# EAGLE design diyAutoSteer (EAGLE 9.5.1)
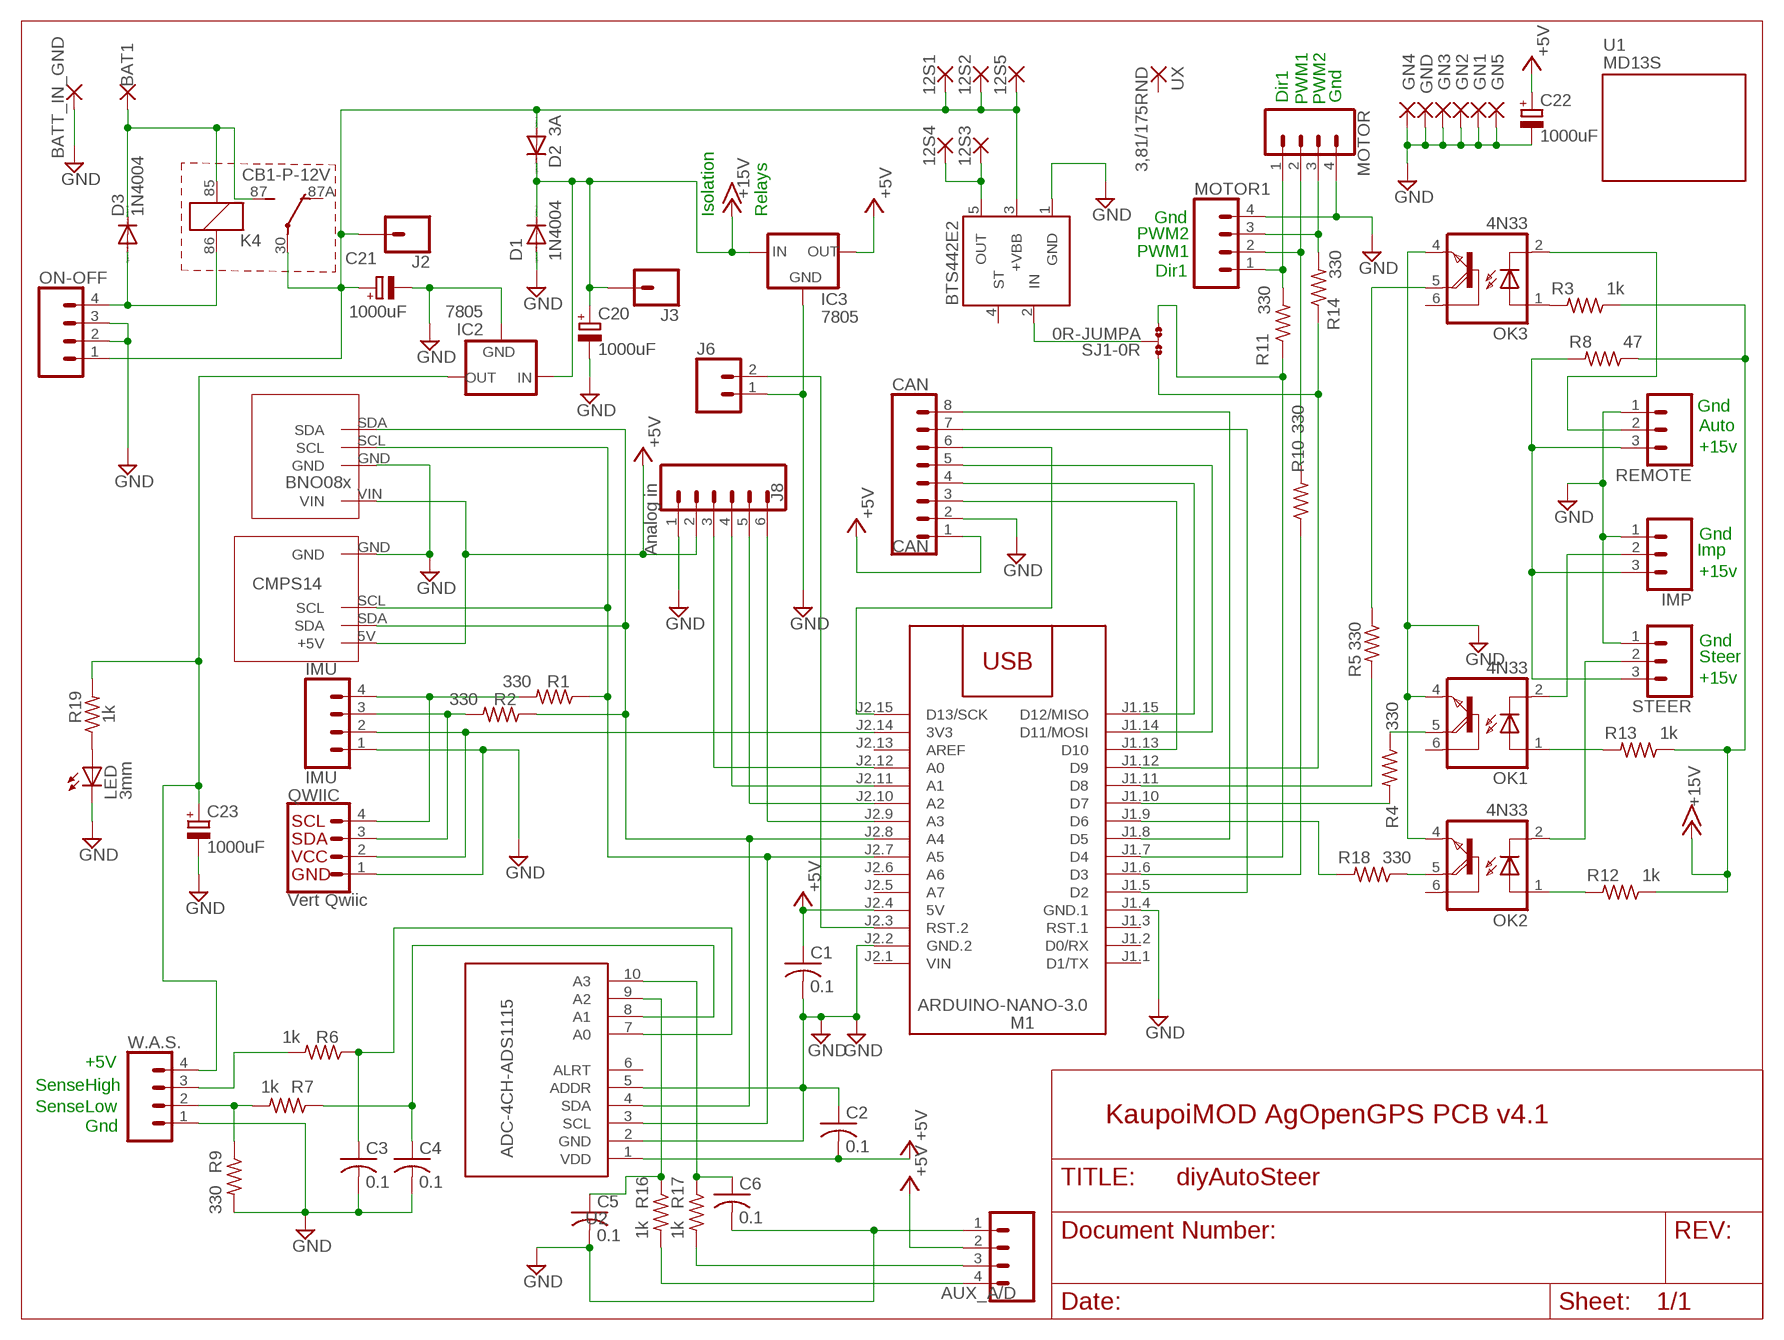
[diagram p0: schematic, sheet 1]

## Parts
12S1  3,81/1,65  [3,81/1,65]
12S2  3,81/1,65  [3,81/1,65]
12S3  3,81/1,65  [3,81/1,65]
12S4  3,81/1,65  [3,81/1,65]
12S5  3,81/1,65  [3,81/1,65]
AUX_A/D  CONN_04LONGPADS  [1X04_LONGPADS]
BAT1  3,81/1,65  [3,81/1,65]
BATT_IN_GND  3,81/1,65  [3,81/1,65]
C1  0.1  C-US025-025X050  [C025-025X050]
C2  0.1  C-US025-025X050  [C025-025X050]
C3  0.1  C-US025-025X050  [C025-025X050]
C4  0.1  C-US025-025X050  [C025-025X050]
C5  0.1  C-US025-025X050  [C025-025X050]
C6  0.1  C-US025-025X050  [C025-025X050]
C20  1000uF  CPOL-EUE5-13  [E5-13]
C21  1000uF  CPOL-EUE5-13  [E5-13]
C22  1000uF  CPOL-EUE5-13  [E5-13]
C23  1000uF  CPOL-EUE5-13  [E5-13]
CAN  CAN  CONN_08NO_SILK_FEMALE_PTH  [1X08_NO_SILK]
D1  1N4004  [DO41-10]
D2  3A  DIODE-DO27-15  [DO27-15]
D3  1N4004  [DO41-10]
GN1  3,81/1,65  [3,81/1,65]
GN2  3,81/1,65  [3,81/1,65]
GN3  3,81/1,65  [3,81/1,65]
GN4  3,81/1,65  [3,81/1,65]
GN5  3,81/1,65  [3,81/1,65]
GND  3,81/1,65  [3,81/1,65]
IC2  7805  78XXS  [78XXS]
IC3  7805  78XXS  [78XXS]
IMP  CONN_03LONGPADS  [1X03_LONGPADS]
IMU  IMU  CONN_04LONGPADS  [1X04_LONGPADS]
J2  CONN_01  [1X01]
J3  CONN_01  [1X01]
J6  CONN_02PTH3  [1X02_LONGPADS]
J8  Analog in  CONN_06NO_SILK_NO_POP  [1X06_NO_SILK]
K4  CB1-P-12V  [CB1]
LED  3mm  LED3MM  [LED3MM]
M1  ARDUINO-NANO-3.0  [ARDUINO-NANO-3.0]
MOTOR  CONN_04LONGPADS  [1X04_LONGPADS]
MOTOR1  CONN_04LONGPADS  [1X04_LONGPADS]
OK1  4N33  [DIL06]
OK2  4N33  [DIL06]
OK3  4N33  [DIL06]
ON-OFF  CONN_04LONGPADS  [1X04_LONGPADS]
QWIIC  Vert Qwiic  QWIIC_CONNECTOR  [JST04_1MM_VERT]
R1  330  R-US_0309/12  [0309/12]
R2  330  R-US_0309/12  [0309/12]
R3  1k  R-US_0309/12  [0309/12]
R4  330  R-US_0309/12  [0309/12]
R5  330  R-US_0309/12  [0309/12]
R6  1k  R-US_0309/12  [0309/12]
R7  1k  R-US_0309/12  [0309/12]
R8  47  R-US_0309/12  [0309/12]
R9  330  R-US_0309/12  [0309/12]
R10  330  R-US_0309/12  [0309/12]
R11  330  R-US_0309/12  [0309/12]
R12  1k  R-US_0309/12  [0309/12]
R13  1k  R-US_0309/12  [0309/12]
R14  330  R-US_0309/12  [0309/12]
R16  1k  R-US_0309/12  [0309/12]
R17  1k  R-US_0309/12  [0309/12]
R18  330  R-US_0309/12  [0309/12]
R19  1k  R-US_0309/12  [0309/12]
REMOTE  CONN_03LONGPADS  [1X03_LONGPADS]
SJ1  0R-JUMPA  [A0R-JMP]
STEER  CONN_03LONGPADS  [1X03_LONGPADS]
U1  MD13S  [MD13S]
U2  ADC-4CH-ADS1115  [ADC-4CH-ADS1115]
U3  BTS442E2  [TO220-5]
U4  CMPS14  [CMPS14]
U5  BNO085  [BNO085]
UX  3,81/175RND  [3,81/1,75RND]
W.A.S.  CONN_04LONGPADS  [1X04_LONGPADS]

## Nets
+5V: AUX_A/D.2 C1.1 C2.2 C22.+ CAN.1 IC3.OUT J8.2 M1.J2.4(5V) U2.1(VDD) U4.5V(+5V) U5.VIN
+15V: C20.+ D1.C D2.C IC2.IN IC3.IN J3.1 R3.1 R8.1 R12.1 R13.1
BATT: BAT1.P$1(P) D3.C K4.85 K4.87(2:S)
DIR: MOTOR1.1 MOTOR.1 R11.2
GND: AUX_A/D.1 BATT_IN_GND.P$1(P) C1.2 C2.1 C3.2 C4.2 C5.2 C6.2 C20.- C21.- C22.- C23.- CAN.2 D1.A GN1.P$1(P) GN2.P$1(P) GN3.P$1(P) GN4.P$1(P) GN5.P$1(P) GND.P$1(P) IC2.GND IC3.GND IMP.1 IMU.1 J6.1 J8.1 LED.K(C) M1.J1.4(GND.1) M1.J2.2(GND.2) MOTOR1.4 MOTOR.4 OK1.4(E) OK2.4(E) OK3.4(E) ON-OFF.2 ON-OFF.3 QWIIC.1 R9.2 REMOTE.1 STEER.1 U2.2(GND) U2.5(ADDR) U3.1(GND) U4.GND U5.GND W.A.S..1
N$1: IMU.2 M1.J2.14(3V3) QWIIC.2
N$2: R7.2 R9.1 W.A.S..2
N$3: IMP.3 R8.2 REMOTE.3 STEER.3
N$4: M1.J1.6(D3) R10.1
N$5: M1.J1.7(D4) R11.1 SJ1.3
N$6: CAN.7 M1.J1.5(D2)
N$7: J6.2 M1.J2.3(RST.2)
N$8: R6.2 W.A.S..3
N$9: CAN.8 M1.J1.8(D5)
N$10: J8.4 M1.J2.11(A1)
N$11: M1.J1.12(D9) R14.1 SJ1.1
N$12: IMU.3 QWIIC.3 R2.2
N$13: IMU.4 QWIIC.4 R1.2
N$14: J8.5 M1.J2.10(A2)
N$15: J8.6 M1.J2.9(A3)
N$16: LED.A R19.1
N$17: CAN.6 M1.J2.15(D13/SCK)
N$18: AUX_A/D.3 R17.2
N$19: OK1.5(COL) R4.1
N$20: C3.1 R6.1 U2.7(A0)
N$21: CAN.5 M1.J1.14(D11/MOSI)
N$22: OK2.2(C) STEER.2
N$23: M1.J1.11(D8) R5.2
N$24: D3.A K4.86 ON-OFF.4
N$25: OK2.1(A) R12.2
N$26: OK3.1(A) R3.2
N$27: M1.J1.10(D7) R4.2
N$28: OK3.2(C) REMOTE.2
N$29: IMP.2 OK1.2(C)
N$30: J8.3 M1.J2.12(A0)
N$31: M1.J1.9(D6) R18.2
N$32: OK1.1(A) R13.2
N$33: CAN.4 M1.J1.15(D12/MISO)
N$34: OK3.5(COL) R5.1
N$35: C6.1 R17.1 U2.10(A3)
N$36: C5.1 R16.1 U2.9(A2)
N$37: CAN.3 M1.J1.13(D10)
N$38: M1.J2.7(A5) R1.1 U2.3(SCL) U4.SCL U5.SCL
N$39: OK2.5(COL) R18.1
N$40: 12S3.P$1(P) 12S4.P$1(P) U3.5(OUT)
N$41: SJ1.2 U3.2(IN)
N$44: C4.1 R7.1 U2.8(A1)
N$47: AUX_A/D.4 R16.2
PWM1: MOTOR1.2 MOTOR.2 R10.2
PWM2: MOTOR1.3 MOTOR.3 R14.2
SDA: M1.J2.8(A4) R2.1 U2.4(SDA) U4.SDA U5.SDA
SW_RAW: 12S1.P$1(P) 12S2.P$1(P) 12S5.P$1(P) C21.+ D2.A J2.1 K4.30(2:P) ON-OFF.1 U3.3(+VBB)
V+WAS: C23.+ IC2.OUT R19.2 W.A.S..4
Unconnected: K4.87A(2:O) M1.J1.1(D1/TX) M1.J1.2(D0/RX) M1.J1.3(RST.1) M1.J2.5(A7) M1.J2.6(A6) M1.J2.13(AREF) OK1.6(B) OK2.6(B) OK3.6(B) U2.6(ALRT) U3.4(ST) UX.P$1(P)

## Notes on the sheet
- Dir1 | PWM1 | PWM2 | Gnd
- Gnd
- Isolation | Relays
- PWM2
- PWM1
- Dir1
- Gnd
- Auto
- +15v
- Gnd
- Imp
- +15v
- Gnd
- Steer
- +15v
- +5V
- Sense | High
- Sense | Low
- KaupoiMOD AgOpenGPS PCB v4.1
- Gnd

## Power pins joined to a net without a drawn wire
VIN: M1.J2.1(VIN)

## Library data of the parts
12S1-12S5 BAT1 BATT_IN_GND GN1-GN5 GND = wirepad:3,81/1,65: 3,81/1,65
AUX_A/D IMU MOTOR MOTOR1 ON-OFF W.A.S. = SparkFun-Connectors:CONN_04: Multi connection point. Often used as Generic Header-pin footprint for 0.1 inch spaced/style header connections On any of the 0.1 inch spaced packages, you can populate with these: Break Away Headers - Straight <https://www.sparkfun.com/products/116> (PRT-00116) Break Away Male Headers - Right Angle <https://www.sparkfun.com/products/553> (PRT-00553) Female Headers <https://www.sparkfun.com/products/115> (PRT-00115) Break Away Headers - Machine Pin <https://www.sparkfun.com/products/117> (PRT-00117) Break Away Female Headers - Swiss Machine Pin <https://www.sparkfun.com/products/743> (PRT-00743) For SCREWTERMINALS and SPRING TERMINALS visit here: Screw Terimnals on SparkFun.com <https://www.sparkfun.com/search/results?term=Screw+Terminals> (5mm/3.5mm/2.54mm spacing) This device is also useful as a general connection point to wire up your design to another part of your project. Our various solder wires solder well into these plated through hole pads. Hook-Up Wire - Assortment (Stranded, 22 AWG) <https://www.sparkfun.com/products/11375> (PRT-11375) Hook-Up Wire - Assortment (Solid Core, 22 AWG) <https://www.sparkfun.com/products/11367> (PRT-11367) View the entire wire category on our website here <https://www.sparkfun.com/categories/141> Special notes: Molex polarized connector foot print use with SKU : PRT-08231 with associated crimp pins and housings. 1MM SMD Version SKU: PRT-10208; PROD_ID: CONN-09696
C1-C6 = rcl:C-US: CAPACITOR, American symbol
C20 = rcl:CPOL-EU: POLARIZED CAPACITOR, European symbol; SPICEPREFIX: C
C21-C23 = rcl:CPOL-EU: POLARIZED CAPACITOR, European symbol
CAN = SparkFun-Connectors:CONN_08: Multi connection point. Often used as Generic Header-pin footprint for 0.1 inch spaced/style header connections On any of the 0.1 inch spaced packages, you can populate with these: Break Away Headers - Straight <https://www.sparkfun.com/products/116> (PRT-00116) Break Away Male Headers - Right Angle <https://www.sparkfun.com/products/553> (PRT-00553) Female Headers <https://www.sparkfun.com/products/115> (PRT-00115) Break Away Headers - Machine Pin <https://www.sparkfun.com/products/117> (PRT-00117) Break Away Female Headers - Swiss Machine Pin <https://www.sparkfun.com/products/743> (PRT-00743) Arduino Stackable Header - 8 Pin <https://www.sparkfun.com/products/9279> (PRT-09279) For SCREWTERMINALS and SPRING TERMINALS visit here: Screw Terimnals on SparkFun.com <https://www.sparkfun.com/search/results?term=Screw+Terminals> (5mm/3.5mm/2.54mm spacing) This device is also useful as a general connection point to wire up your design to another part of your project. Our various solder wires solder well into these plated through hole pads. Hook-Up Wire - Assortment (Stranded, 22 AWG) <https://www.sparkfun.com/products/11375> (PRT-11375) Hook-Up Wire - Assortment (Solid Core, 22 AWG) <https://www.sparkfun.com/products/11367> (PRT-11367) View the entire wire category on our website here <https://www.sparkfun.com/categories/141> Special notes: Molex polarized connector foot print use with SKU : PRT-08231 with associated crimp pins and housings. 1MM SMD Version SKU: PRT-10208 NOTES ON THE VARIANTS LOCK and LOCK_LONGPADS... This footprint was designed to help hold the alignment of a through-hole component (i.e. 6-pin header) while soldering it into place. You may notice that each hole has been shifted either up or down by 0.005 of an inch from it's more standard position (which is a perfectly straight line). This slight alteration caused the pins (the squares in the middle) to touch the edges of the holes. Because they are alternating, it causes a "brace" to hold the component in place. 0.005 has proven to be the perfect amount of "off-center" position when using our standard breakaway headers. Although looks a little odd when you look at the bare footprint, once you have a header in there, the alteration is very hard to notice. Also,if you push a header all the way into place, it is covered up entirely on the bottom side.; PROD_ID: CONN-08438
D1 D3 = diode:1N4004: DIODE general purpose rectifier, 1 A
D2 = diode:DIODE-: DIODE
IC2 IC3 = v-reg:78XXS: VOLTAGE REGULATOR
IMP REMOTE STEER = SparkFun-Connectors:CONN_03: Multi connection point. Often used as Generic Header-pin footprint for 0.1 inch spaced/style header connections On any of the 0.1 inch spaced packages, you can populate with these: Break Away Headers - Straight <https://www.sparkfun.com/products/116> (PRT-00116) Break Away Male Headers - Right Angle <https://www.sparkfun.com/products/553> (PRT-00553) Female Headers <https://www.sparkfun.com/products/115> (PRT-00115) Break Away Headers - Machine Pin <https://www.sparkfun.com/products/117> (PRT-00117) Break Away Female Headers - Swiss Machine Pin <https://www.sparkfun.com/products/743> (PRT-00743) Stackable Header - 3 Pin (Female, 0.1") <https://www.sparkfun.com/products/13875> (PRT-13875) For SCREWTERMINALS and SPRING TERMINALS visit here: Screw Terimnals on SparkFun.com <https://www.sparkfun.com/search/results?term=Screw+Terminals> (5mm/3.5mm/2.54mm spacing) This device is also useful as a general connection point to wire up your design to another part of your project. Our various solder wires solder well into these plated through hole pads. Hook-Up Wire - Assortment (Stranded, 22 AWG) <https://www.sparkfun.com/products/11375> (PRT-11375) Hook-Up Wire - Assortment (Solid Core, 22 AWG) <https://www.sparkfun.com/products/11367> (PRT-11367) View the entire wire category on our website here <https://www.sparkfun.com/categories/141> Special notes: Molex polarized connector foot print use with SKU : PRT-08232 with associated crimp pins and housings.
J2 J3 = SparkFun-Connectors:CONN_01: Single connection point. Often used as Generic Header-pin footprint for 0.1 inch spaced/style header connections On any of the 0.1 inch spaced packages, you can populate with these: Break Away Headers - Straight <https://www.sparkfun.com/products/116> (PRT-00116) Break Away Male Headers - Right Angle <https://www.sparkfun.com/products/553> (PRT-00553) Female Headers <https://www.sparkfun.com/products/115> (PRT-00115) Break Away Headers - Machine Pin <https://www.sparkfun.com/products/117> (PRT-00117) Break Away Female Headers - Swiss Machine Pin <https://www.sparkfun.com/products/743> (PRT-00743) This device is also useful as a general connection point to wire up your design to another part of your project. Our various solder wires solder well into these plated through hole pads. Hook-Up Wire - Assortment (Stranded, 22 AWG) <https://www.sparkfun.com/products/11375> (PRT-11375) Hook-Up Wire - Assortment (Solid Core, 22 AWG) <https://www.sparkfun.com/products/11367> (PRT-11367) View the entire wire category on our website here <https://www.sparkfun.com/categories/141> Special notes: SMTSO-256-ET is a "flush mount" nut for a 4-40 screw. We mostly use this on specialty testbeds; it is a nice way to connect hardware to your PCB at an adjustable hieght. Also note, the SNAP packages are for using a snappable style connector. We sell a baggie of snaps and they are also used on two LilyPad designs: Snap Assortment - 30 pack (male and female) <https://www.sparkfun.com/products/11347> (DEV-11347) LilyPad Arduino SimpleSnap <https://www.sparkfun.com/products/10941> (DEV-10941) LilyPad SimpleSnap Protoboard <https://www.sparkfun.com/products/10940> (DEV-10940)
J6 = SparkFun-Connectors:CONN_02: Multi connection point. Often used as Generic Header-pin footprint for 0.1 inch spaced/style header connections On any of the 0.1 inch spaced packages, you can populate with these: Break Away Headers - Straight <https://www.sparkfun.com/products/116> (PRT-00116) Break Away Male Headers - Right Angle <https://www.sparkfun.com/products/553> (PRT-00553) Female Headers <https://www.sparkfun.com/products/115> (PRT-00115) Break Away Headers - Machine Pin <https://www.sparkfun.com/products/117> (PRT-00117) Break Away Female Headers - Swiss Machine Pin <https://www.sparkfun.com/products/743> (PRT-00743) For SCREWTERMINALS and SPRING TERMINALS visit here: Screw Terimnals on SparkFun.com <https://www.sparkfun.com/search/results?term=Screw+Terminals> (5mm/3.5mm/2.54mm spacing) This device is also useful as a general connection point to wire up your design to another part of your project. Our various solder wires solder well into these plated through hole pads. Hook-Up Wire - Assortment (Stranded, 22 AWG) <https://www.sparkfun.com/products/11375> (PRT-11375) Hook-Up Wire - Assortment (Solid Core, 22 AWG) <https://www.sparkfun.com/products/11367> (PRT-11367) View the entire wire category on our website here <https://www.sparkfun.com/categories/141> Special notes: Molex polarized connector foot print use with: PRT-08233 with associated crimp pins and housings. 2.54_SCREWTERM for use with PRT-10571. 3.5mm Screw Terminal footprints for PRT-08084 5mm Screw Terminal footprints for use with PRT-08432
J8 = SparkFun-Connectors:CONN_06: Multi connection point. Often used as Generic Header-pin footprint for 0.1 inch spaced/style header connections On any of the 0.1 inch spaced packages, you can populate with these: Break Away Headers - Straight <https://www.sparkfun.com/products/116> (PRT-00116) Break Away Male Headers - Right Angle <https://www.sparkfun.com/products/553> (PRT-00553) Female Headers <https://www.sparkfun.com/products/115> (PRT-00115) Break Away Headers - Machine Pin <https://www.sparkfun.com/products/117> (PRT-00117) Break Away Female Headers - Swiss Machine Pin <https://www.sparkfun.com/products/743> (PRT-00743) Arduino Stackable Header - 6 Pin <https://www.sparkfun.com/products/9280> (PRT-09280) For SCREWTERMINALS and SPRING TERMINALS visit here: Screw Terimnals on SparkFun.com <https://www.sparkfun.com/search/results?term=Screw+Terminals> (5mm/3.5mm/2.54mm spacing) This device is also useful as a general connection point to wire up your design to another part of your project. Our various solder wires solder well into these plated through hole pads. Hook-Up Wire - Assortment (Stranded, 22 AWG) <https://www.sparkfun.com/products/11375> (PRT-11375) Hook-Up Wire - Assortment (Solid Core, 22 AWG) <https://www.sparkfun.com/products/11367> (PRT-11367) View the entire wire category on our website here <https://www.sparkfun.com/categories/141>
K4 = relay:CB1*: HIGH POWER AUTOMOTIVE RELAY Form C NAiS Source: http://www.mew-europe.com/.. en_ds_61202_0000.pdf; MF: AROMAT/ MATSUSHITA; MPN: CB1-P-12V; OC_FARNELL: unknown; OC_NEWARK: 52F9201
LED = led:LED: LED OSRAM: - CHIPLED LG R971, LG N971, LY N971, LG Q971, LY Q971, LO R971, LY R971 LH N974, LH R974 LS Q976, LO Q976, LY Q976 LO Q996 - Hyper CHIPLED LW Q18S LB Q993, LB Q99A, LB R99A - SideLED LS A670, LO A670, LY A670, LG A670, LP A670 LB A673, LV A673, LT A673, LW A673 LH A674 LY A675 LS A676, LA A676, LO A676, LY A676, LW A676 LS A679, LY A679, LG A679 - Hyper Micro SIDELED® LS Y876, LA Y876, LO Y876, LY Y876 LT Y87S - SmartLED LW L88C, LW L88S LB L89C, LB L89S, LG L890 LS L89K, LO L89K, LY L89K LS L896, LA L896, LO L896, LY L896 - TOPLED LS T670, LO T670, LY T670, LG T670, LP T670 LSG T670, LSP T670, LSY T670, LOP T670, LYG T670 LG T671, LOG T671, LSG T671 LB T673, LV T673, LT T673, LW T673 LH T674 LS T676, LA T676, LO T676, LY T676, LB T676, LH T676, LSB T676, LW T676 LB T67C, LV T67C, LT T67C, LS T67K, LO T67K, LY T67K, LW E67C LS E67B, LA E67B, LO E67B, LY E67B, LB E67C, LV E67C, LT E67C LW T67C LS T679, LY T679, LG T679 LS T770, LO T770, LY T770, LG T770, LP T770 LB T773, LV T773, LT T773, LW T773 LH T774 LS E675, LA E675, LY E675, LS T675 LS T776, LA T776, LO T776, LY T776, LB T776 LHGB T686 LT T68C, LB T68C - Hyper Mini TOPLED® LB M676 - Mini TOPLED Santana® LG M470 LS M47K, LO M47K, LY M47K Source: http://www.osram.convergy.de LUXEON: - LUMILED® LXK2-PW12-R00, LXK2-PW12-S00, LXK2-PW14-U00, LXK2-PW14-V00 LXK2-PM12-R00, LXK2-PM12-S00, LXK2-PM14-U00 LXK2-PE12-Q00, LXK2-PE12-R00, LXK2-PE12-S00, LXK2-PE14-T00, LXK2-PE14-U00 LXK2-PB12-K00, LXK2-PB12-L00, LXK2-PB12-M00, LXK2-PB14-N00, LXK2-PB14-P00, LXK2-PB14-Q00 LXK2-PR12-L00, LXK2-PR12-M00, LXK2-PR14-Q00, LXK2-PR14-R00 LXK2-PD12-Q00, LXK2-PD12-R00, LXK2-PD12-S00 LXK2-PH12-R00, LXK2-PH12-S00 LXK2-PL12-P00, LXK2-PL12-Q00, LXK2-PL12-R00 Source: www.luxeon.com KINGBRIGHT: KA-3528ASYC Source: www.kingbright.com
M1 = diy-modules:ARDUINO-NANO-3.0: Arduino Nano 3.0 and compatible devices More details available here: https://www.arduino.cc/en/Main/ArduinoBoardNano Click here to find device on ebay.com <http://www.ebay.com/sch/arduino+nano>
OK1-OK3 = optocoupler:4N33: MOTOROLA OPTO COUPLER; MF: VISHAY/TELEFUNKEN; MPN: 4N33; OC_FARNELL: 1469601; OC_NEWARK: 88K1390
QWIIC = SparkFun-Connectors:QWIIC_CONNECTOR: SparkFun I2C Standard Qwiic Connector An SMD 1mm pitch JST connector makes it easy and quick (get it? Qwiic?) to connect I2C devices to each other. The Qwiic system <http://www.sparkfun.com/qwiic> enables fast and solderless connection between popular platforms and various sensors and actuators. We carry 200mm <https://www.sparkfun.com/products/14204>, 100mm <https://www.sparkfun.com/products/14205>, 50mm <https://www.sparkfun.com/products/14206>, and breadboard friendly <https://www.sparkfun.com/products/14207> Qwiic cables. We also offer 10 pcs strips <https://www.sparkfun.com/products/14323> the SMD connectors.; PROD_ID: CONN-14483; VALUE: Vertical Qwiic Connector
R1-R14 R16-R19 = rcl:R-US_: RESISTOR, American symbol
SJ1 = jump-0r-smd:0R-JUMP: SMD 0R 0805 Jumper
U1 = cytronMD13Sholes:MD13S: 13Amp DC Motor Driver (MD13S) Created by: Wai Weng; CYTRON-PC: MD13S; DESC: 13Amp DC Motor Driver - GROVE Compatible; MF: Cytron; MPN: MD13S
U2 = diy-modules:ADC-4CH-ADS1115: 4 Channel 16-Bit Analog-to-Digital Converter based on ADS1115 chip Arduino ADS1115 Getting Started Tutorial is available here: http://henrysbench.capnfatz.com/henrys-bench/arduino-voltage-measurements/arduino-ads1115-module-getting-started-tutorial/ ADS1115 datasheet is available here: http://www.ti.com/lit/ds/symlink/ads1115.pdf Click here to find device on ebay.com <http://www.ebay.com/sch/ads1115+module>
U3 = v-reg-3:BTS442E2
U4 = IMU:CMPS14: CMPS14
U5 = IMU:BNO085
UX = wirepad:3,81/175RND

## Module MOTOR_CONTROLLER
Ports: 

### Library data of the parts

## Net classes
0 default: clearance 0.205 mm

## Board
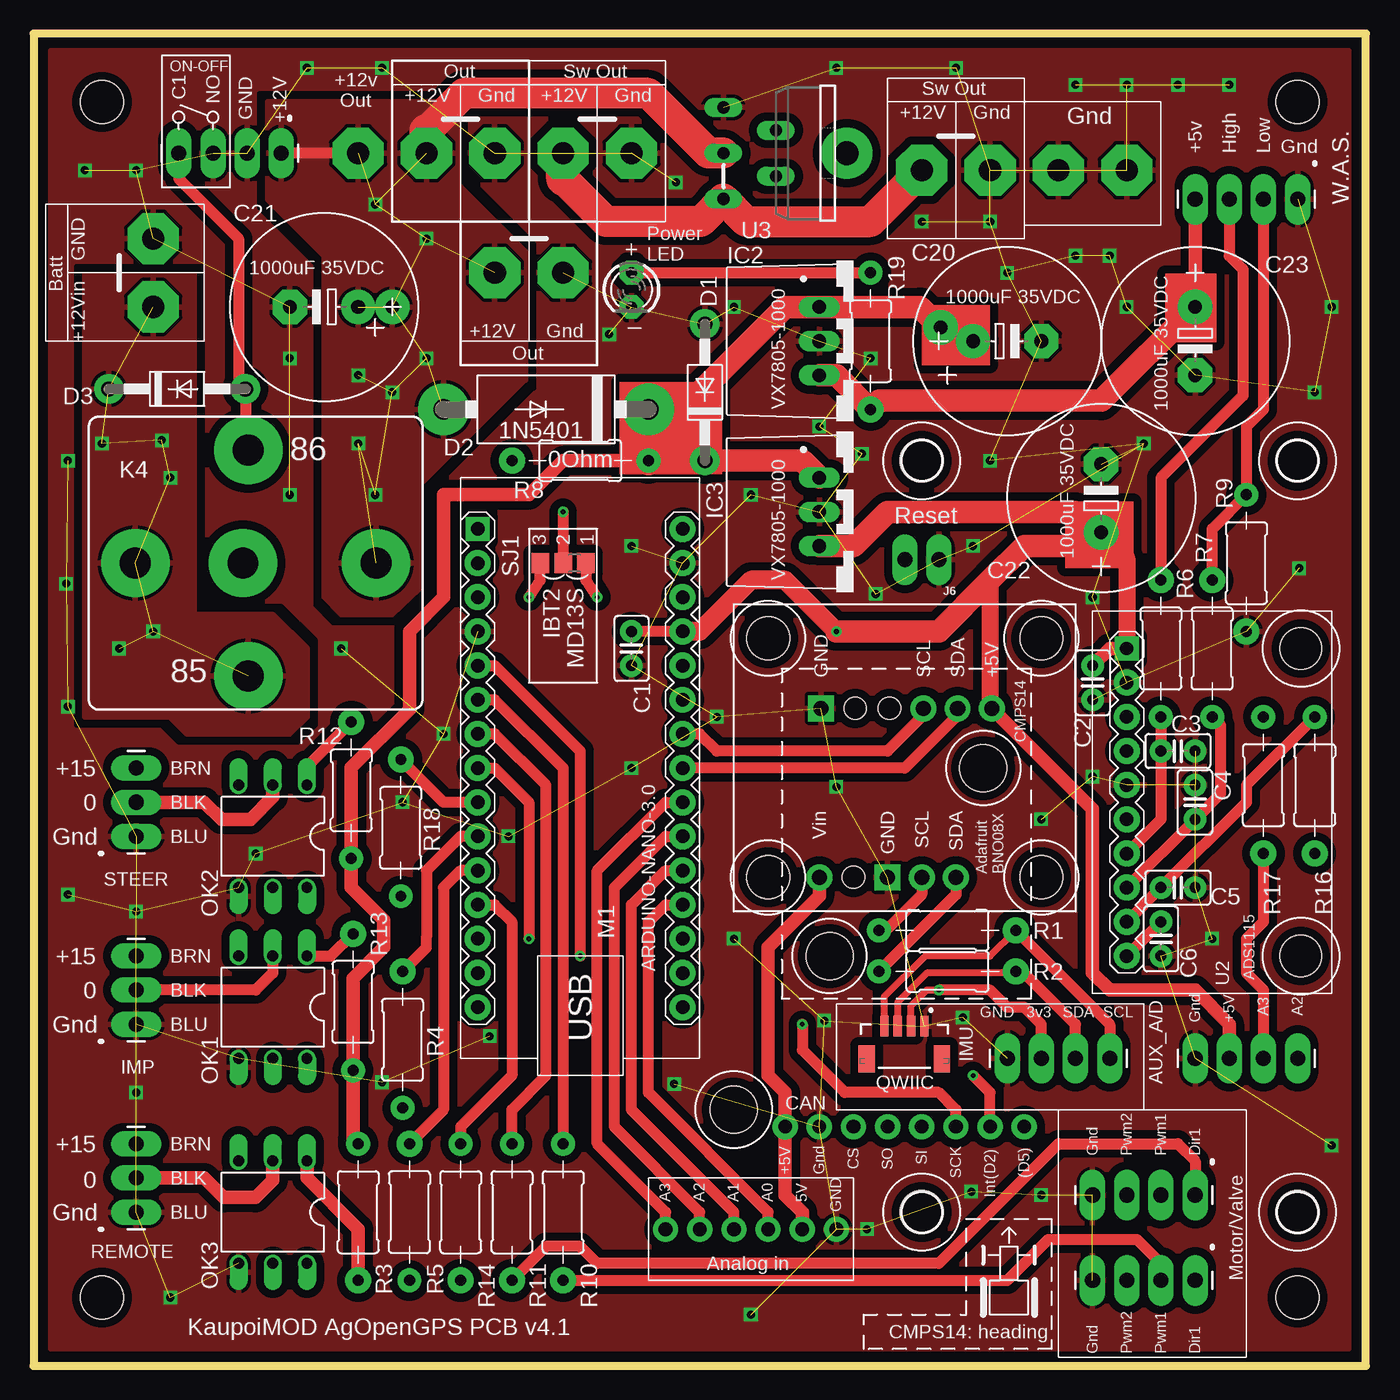
[diagram p1: board, top side]
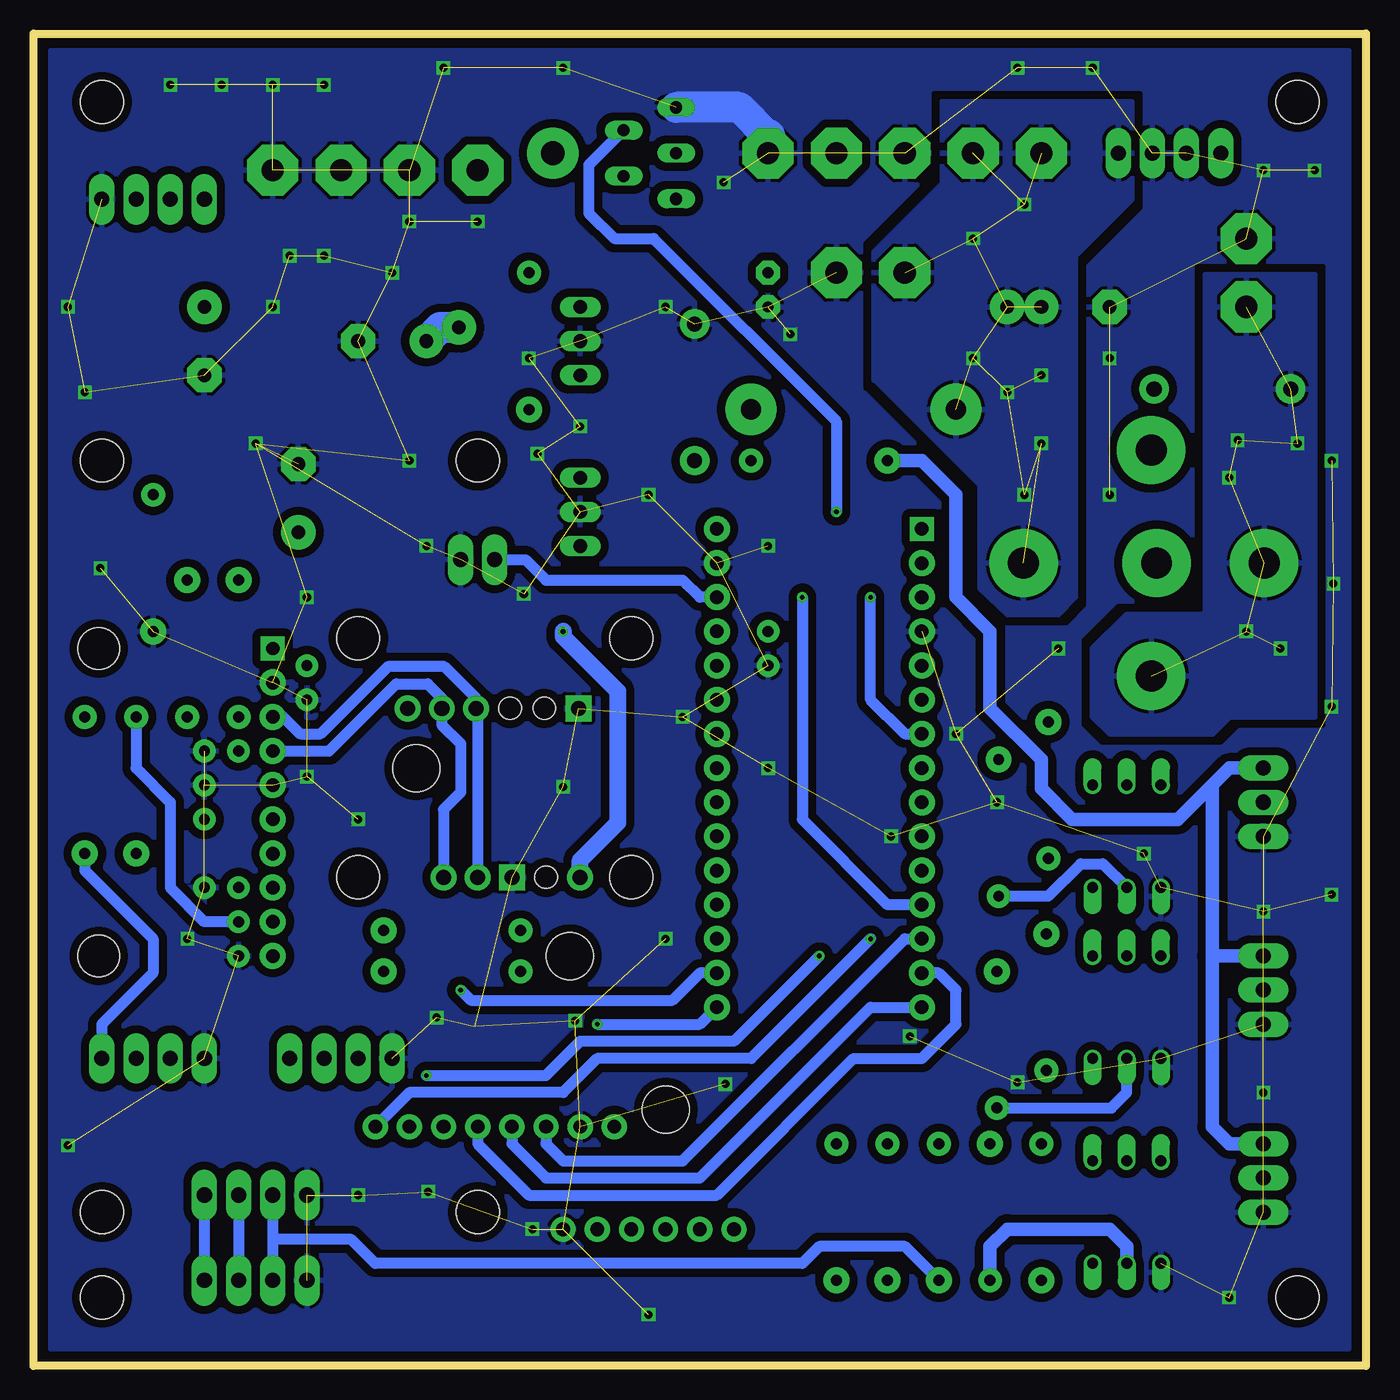
[diagram p2: board, bottom side, seen from below]

Size 99.06 x 99.06 mm. Coordinates in mm from the lower left corner, seen from the top.
Outline: 0,0 99.06,0 99.06,99.06 0,99.06 0,0
Copper layers (1*16): Top 0.035mm / dielectric 1.5mm / Bottom 0.035mm
Design rules "default *": minimum track width 16mil, minimum drill 0.35mm, track to track 6mil, track to pad 6mil, pad to pad 6mil, via to via 6mil, smd to smd 6mil, copper to edge 8mil, drill to drill 6mil, minimum pad ring 10mil, minimum via ring 8mil, stop-mask expansion 4mil, vias tented up to drill 0mil, thermal gap 10mil
Holes 3.2 mm at 5.08,5.08 93.98,5.08 5.08,93.98 93.98,93.98
Holes 3.5 mm at 52.07,19.05

### Footprints (pad centres in the part's own frame; a part is rotated, then mirrored left to right if it is on the bottom)
3,81/1,65 = drill 1.651 pad 3.81 octagon: P$1 0,0
1X04_LONGPADS = drill 1.118 pad 1.88 long: 1 0,0; 2 2.54,0; 3 5.08,0; 4 7.62,0
C025-025X050 = drill 0.813 pad 1.676: 1 -1.27,0; 2 1.27,0
E5-13 = drill 1.016 pad 2.54: + -2.54,0 | drill 1.016 pad 2.54 octagon: - 2.54,0
1X08_NO_SILK = drill 1.016 pad 1.88: 1 0,0; 2 2.54,0; 3 5.08,0; 4 7.62,0; 5 10.16,0; 6 12.7,0; 7 15.24,0; 8 17.78,0
DO41-10 = drill 1.118 pad 2.184: A 5.08,0; C -5.08,0
DO27-15 = drill 1.499 pad 3.81: A 7.62,0; C -7.62,0
78XXS = drill 1.016 long: GND 0,-2.54; IN -2.54,-2.54; OUT 2.54,-2.54
1X03_LONGPADS = drill 1.118 pad 1.88 long: 1 0,0; 2 2.54,0; 3 5.08,0
1X01 = drill 1.016 pad 2.54: 1 0,0
1X02_LONGPADS = drill 1.118 pad 1.88 long: 1 0,0; 2 2.54,0
1X06_NO_SILK = drill 1.016 pad 1.88: 1 0,0; 2 2.54,0; 3 5.08,0; 4 7.62,0; 5 10.16,0; 6 12.7,0
CB1 = drill 2.3 pad 5.08: 30 8.95,0; 85 -0.55,-8.4; 86 -0.55,8.4; 87 -8.95,0; 87A -0.95,0
LED3MM = drill 0.813 pad 1.778 octagon: A -1.27,0; K 1.27,0
ARDUINO-NANO-3.0 = drill 1 pad 1.778 square: J1.1 17.78,7.62 | drill 1 pad 1.93: J1.2 15.24,7.62; J1.3 12.7,7.62; J1.4 10.16,7.62; J1.5 7.62,7.62; J1.6 5.08,7.62; J1.7 2.54,7.62; J1.8 0,7.62; J1.9 -2.54,7.62; J1.10 -5.08,7.62; J1.11 -7.62,7.62; J1.12 -10.16,7.62; J1.13 -12.7,7.62; J1.14 -15.24,7.62; J1.15 -17.78,7.62; J2.1 17.78,-7.62; J2.2 15.24,-7.62; J2.3 12.7,-7.62; J2.4 10.16,-7.62; J2.5 7.62,-7.62; J2.6 5.08,-7.62; J2.7 2.54,-7.62; J2.8 0,-7.62; J2.9 -2.54,-7.62; J2.10 -5.08,-7.62; J2.11 -7.62,-7.62; J2.12 -10.16,-7.62; J2.13 -12.7,-7.62; J2.14 -15.24,-7.62; J2.15 -17.78,-7.62
DIL06 = drill 0.813 offset: 1 -2.54,-3.81; 2 0,-3.81; 3 2.54,-3.81; 4 2.54,3.81; 5 0,3.81; 6 -2.54,3.81
JST04_1MM_VERT = smd 0.6 x 1.55: 1 -1.478,0.775; 2 -0.478,0.775; 3 0.522,0.775; 4 1.522,0.775 | smd 1.2 x 2: NC1 -2.778,3.2; NC2 2.822,3.2
0309/12 = drill 0.813 pad 1.778: 1 -5.08,0 | drill 0.813 pad 1.93: 2 5.08,0
A0R-JMP = smd 1.5 x 1.3: 1 0,1.7; 2 0,0; 3 0,-1.7
MD13S = hole 3.2: 2.54,30.48; 2.54,2.54; 58.42,2.54; 58.42,30.48
ADC-4CH-ADS1115 = drill 1 pad 1.778 square: 1 -6.35,11.43 | drill 1 pad 1.93: 2 -6.35,8.89; 3 -6.35,6.35; 4 -6.35,3.81; 5 -6.35,1.27; 6 -6.35,-1.27; 7 -6.35,-3.81; 8 -6.35,-6.35; 9 -6.35,-8.89; 10 -6.35,-11.43 | hole 3.1: 6.604,11.43; 6.604,-11.43
TO220-5 = drill 0.9 long: 1 -3.4,-8.4; 2 -1.7,-4.5; 3 0,-8.4; 4 1.7,-4.5; 5 3.4,-8.4
CMPS14 = drill 1.118 pad 1.93: 5V 10.16,-6.35; SCL 10.16,-1.27; SDA 10.16,-3.81 | drill 1.118 pad 1.93 square: GND 10.16,6.35 | hole 3.5: 5.715,-5.715; -8.255,5.715 | hole 1.676: 10.16,1.27; 10.16,3.81
BNO085 = drill 1.118 pad 1.93 square: GND 8.89,-1.27 | drill 1.118 pad 1.93: SCL 8.89,1.27; SDA 8.89,3.81; VIN 8.89,-6.35 | hole 3.2: 8.89,10.16; 8.89,-10.16; -8.89,-10.16; -8.89,10.16 | hole 1.651: 8.89,-3.81
3,81/1,75RND = drill 1.75 pad 3.81: P$1 0,0

### Placement (x,y rotation side)
12S1  29.21,90.17 0 top
12S2  24.13,90.17 0 top
12S3  39.37,90.17 0 top
12S4  66.04,88.9 0 top
12S5  34.29,81.28 0 top
AUX_A/D  86.36,22.86 0 top
BAT1  8.89,78.74 0 top
BATT_IN_GND  8.89,83.82 0 top
C1  44.45,53.34 270 top
C2  78.74,50.8 90 top
C3  85.09,45.72 0 top
C4  86.36,41.91 90 top
C5  85.09,35.56 0 top
C6  83.82,31.75 270 top
C20  72.39,76.2 0 top
C21  21.59,78.74 180 top
C22  79.38,64.52 90 top
C23  86.36,76.2 270 top
CAN  55.88,17.78 0 top
D1  49.91,72.39 90 top
D2  38.1,71.12 180 top
D3  10.67,72.64 0 top
GN1  34.29,90.17 0 top
GN2  71.12,88.9 0 top
GN3  81.28,88.9 0 top
GN4  44.45,90.17 0 top
GN5  39.37,81.28 0 top
GND  76.2,88.9 0 top
IC2  60.96,76.2 270 top
IC3  60.96,63.5 270 top
IMP  7.62,25.4 90 top
IMU  72.39,22.86 0 top
J2  26.67,78.74 0 top
J3  67.44,77.22 0 top
J6  67.31,59.94 180 top
J8  59.69,10.16 180 top
K4  16.51,59.69 0 top
LED  44.45,80.01 270 top
M1  40.64,44.45 90 top
MOTOR  86.36,6.35 180 top
MOTOR1  86.36,12.7 180 top
OK1  17.78,26.67 180 top
OK2  17.78,39.37 180 top
OK3  17.78,11.43 180 top
ON-OFF  18.41,90.17 180 top
QWIIC  64.77,26.04 180 top
R1  67.95,32.38 0 top
R2  67.95,29.34 0 top
R3  24.13,11.43 270 top
R4  27.43,24.26 90 top
R5  27.94,11.43 90 top
R6  83.82,53.34 90 top
R7  87.63,53.34 90 top
R8  40.64,67.31 180 top
R9  90.17,59.69 270 top
R10  39.37,11.43 270 top
R11  35.56,11.43 270 top
R12  23.62,42.8 90 top
R13  23.75,27.05 90 top
R14  31.75,11.43 270 top
R16  95.25,43.18 270 top
R17  91.44,43.18 270 top
R18  27.3,40.01 90 top
R19  62.23,76.2 270 top
REMOTE  7.62,11.43 90 top
SJ1  39.37,59.69 270 top
STEER  7.62,39.37 90 top
U1  96.52,8.89 90 top
U2  87.63,41.91 0 top
U3  59.69,90.17 270 top
U4  64.9,38.73 90 top
U5  64.77,45.21 270 top
UX  60.45,90.17 0 top
W.A.S.  93.98,86.74 180 top

### Tracks (layer width: path | path; a pad name or v marks a point on that pad's centre or on a via)
+5V  (via drill 0.35)
  Top 0.813: M1.J2.4 C1.1
  Top 1.016: U2.1 80.01,53.34 C2.2 | U4.5V 78.74,41.4 78.74,29.21 80.01,27.94 86.36,27.94 88.9,25.4 AUX_A/D.2 | U5.VIN 58.42,34.92 54.61,31.11 54.61,21.59 55.88,20.32 CAN.1 55.88,12.7 57.15,11.43 J8.2
  Top 1.27: C22.+ 81.28,60.07 U2.1 | 71.12,58.42 71.12,49.02 U4.5V
  Top 1.422: v59.69,54.61 55.88,58.42 53.34,58.42 49.53,54.61 M1.J2.4
  Top 1.676: v59.69,54.61 67.31,54.61 71.12,58.42 73.66,60.96 78.36,60.96 C22.+ 78.99,61.98 77.47,63.5 63.5,63.5 60.96,60.96 IC3.OUT
  Bottom 1.27: v59.69,54.61 59.69,54.23 55.63,50.16 55.63,40.39 58.42,37.59 U5.VIN
+15V
  Top 1.016: R3.1 23.75,16.89 R13.1 23.75,28.83 26.04,31.11 26.04,33.15 23.62,35.56 R12.1 23.62,44.49 27.94,48.81 27.94,54.61 30.48,57.15 30.48,64.77 30.49,64.78 36.84,64.78 39.37,67.31 R8.1 49.53,66.93 D1.C
  Top 1.676: D2.C 45.8,71.2 48.34,71.2 55.88,78.74 IC2.IN 65.91,78.74 J3.1 | R8.1 57.15,67.31 IC3.IN
  Top 2.184: R8.1 D2.C
  Bottom 2.286: J3.1 68.83,77.22 C20.+
BATT  (via drill 0.6)  (8 unrouted)
  other vias: 9.53,68.83 5.08,68.58 8.89,54.61 10.16,66.04 6.35,53.34
  pour Bottom (isolate 0.406): 19.05,46.99 20.32,48.26 20.32,53.34 17.78,55.88 11.94,55.88 11.94,81.15 3.81,81.15 3.81,48.26 10.16,48.26 11.43,46.99
  pour Top (isolate 0.406): 3.81,81.15 3.81,48.26 10.16,48.26 11.43,46.99 19.05,46.99 20.32,48.26 20.32,53.34 17.78,55.88 11.94,55.88 11.94,81.15
DIR
  Top 0.813: R11.2 38.1,8.89 40.64,8.89 41.91,7.62 67.31,7.62 76.2,16.51 85.09,16.51 86.36,15.24 MOTOR1.1
  Bottom 0.813: MOTOR1.1 MOTOR.1
GND  (via drill 0.6)  (107 unrouted)
  Bottom 2.286: 44.45,91.44 46.58,93.57 U3.1
  Bottom 2.54: GN4.P$1 44.45,91.44
  other vias: 20.32,96.52 7.62,88.9 42.8,76.71 59.69,96.52 96.52,78.74 47.75,88.01 88.9,95.25 33.91,24.51 81.28,78.74 95.25,72.39 62.23,74.93 61.59,67.82 58.42,69.85 53.34,64.77 27.43,41.91 30.48,46.99 52.07,78.74 66.04,85.09 72.39,81.28 71.12,85.09 77.47,82.55 2.54,67.31 2.54,49.02 7.62,20.32 94.11,59.31 53.34,3.81 47.62,20.95 78.74,57.15 69.09,25.91 3.81,88.9 25.91,96.52 19.05,74.93 19.05,64.77 22.86,53.34 2.41,58.17 7.62,33.78 16.51,38.1 69.85,60.96 81.28,95.25 44.45,44.45 44.45,60.96 85.09,95.25 80.01,82.55 62.61,57.4 71.12,67.31 96.52,16.38 69.72,12.95 78.74,43.81 10.16,5.08 52.07,31.75 82.55,68.58 59.69,43.05 50.8,48.26 87.63,31.75 61.98,10.16 2.54,35.05 77.47,95.25 74.93,12.7 25.91,21.08 58.8,25.65 74.93,40.64 68.58,96.52 35.31,39.37
  pour Bottom (isolate 0.61, rank 2): 1.27,97.79 1.27,1.27 97.79,1.27 97.79,97.79
  pour Top (isolate 0.61, rank 2): 1.27,97.79 1.27,1.27 97.79,1.27 97.79,97.79
N$1  (via drill 0.35)
  Top 0.508: QWIIC.2 65.25,26.77 66.42,27.94 v67.31,27.94
  Top 0.813: IMU.2 74.93,25.4 73.66,26.67 72.39,26.67 71.12,27.94 v67.31,27.94
  Bottom 0.813: M1.J2.14 49.53,29.21 51.56,27.18 66.55,27.18 v67.31,27.94
N$2
  Top 0.813: R7.2 87.63,62.23 R9.1 90.17,69.85 91.44,71.12 W.A.S..2
N$3
  Bottom 1.016: 11.43,43.18 10.16,44.45 STEER.3 | 11.43,43.18 11.43,30.48 | IMP.3 11.43,30.48 | 11.43,30.48 11.43,17.78 10.16,16.51 REMOTE.3 | 11.43,43.18 13.97,40.64 21.84,40.64 24.13,42.93 24.13,45.09 27.94,48.9 27.94,54.61 30.48,57.15 30.48,64.77 33.02,67.31 R8.2
N$4
  Top 0.813: R10.1 39.37,44.45 34.29,49.53 M1.J1.6
N$5  (via drill 0.35)
  Top 0.813: R11.1 35.56,19.05 38.1,21.59 38.1,43.18 34.29,46.99 M1.J1.7 | SJ1.3 37.67,58.42 v36.83,57.15
  Bottom 0.813: M1.J1.7 34.29,46.99 36.83,49.53 v36.83,57.15
N$6  (via drill 0.35)
  Top 0.813: M1.J1.5 34.29,52.07 40.64,45.72 v40.64,30.48 | CAN.7 71.12,20.32 v69.85,21.59
  Bottom 0.813: v40.64,30.48 46.99,24.13 58.42,24.13 60.96,21.59 v69.85,21.59
N$7
  Bottom 0.813: J6.2 62.48,59.94 60.96,58.42 50.8,58.42 49.53,57.15 M1.J2.3
N$8
  Top 0.813: R6.2 83.82,66.04 89.92,72.14 89.92,81.53 88.9,82.55 W.A.S..3
N$9  (via drill 0.35)
  Top 0.813: M1.J1.8 34.29,44.45 36.83,41.91 v36.83,31.75
  Bottom 0.813: v36.83,31.75 45.72,22.86 57.15,22.86 59.69,20.32 71.12,20.32 CAN.8
N$10
  Top 0.813: J8.4 52.07,11.43 44.45,19.05 44.45,34.29 46.99,36.83 M1.J2.11
N$11  (via drill 0.35)
  Top 0.813: M1.J1.12 34.29,34.29 35.56,33.02 35.56,21.59 31.75,17.78 R14.1 | SJ1.1 41.07,58.42 v41.91,57.15
  Bottom 0.813: v41.91,57.15 41.91,40.64 35.56,34.29 M1.J1.12
N$12
  Top 0.508: R2.2 72.9,29.21 66.42,29.21 64.23,27.02 64.23,25.27 QWIIC.3
  Top 0.813: IMU.3 77.47,25.4 73.53,29.34 R2.2
N$13
  Top 0.508: QWIIC.4 63.23,25.27 63.23,27.42 66.29,30.48 71.12,30.48 R1.2
  Top 0.813: R1.2 80.01,25.4 80,22.87 IMU.4
N$14
  Top 0.813: J8.5 49.53,11.43 43.18,17.78 43.18,35.56 46.99,39.37 M1.J2.10
N$15
  Top 0.813: J8.6 46.99,11.43 41.91,16.51 41.91,36.83 46.99,41.91 M1.J2.9
N$16
  Top 0.813: LED.A R19.1
N$17  (via drill 0.35)
  Top 0.813: CAN.6 68.58,19.05 67.31,20.32 60.32,20.32 57.15,23.5 v57.15,25.4
  Bottom 0.813: M1.J2.15 49.53,25.4 v57.15,25.4
N$18
  Top 0.813: R17.2 91.44,33.02 90.17,31.75 90.17,29.21 91.44,27.94 AUX_A/D.3
N$19
  Bottom 0.813: R4.1 18.92,19.18 17.78,20.32 OK1.5
N$20
  Top 0.813: U2.7 83.82,40.64 C3.1 R6.1
N$21
  Bottom 0.813: CAN.5 66.04,16.51 62.23,12.7 48.26,12.7 38.1,22.86 33.02,22.86 30.48,25.4 30.48,27.94 31.75,29.21 M1.J1.14
N$22
  Top 1.016: OK2.2 17.78,42.29 16.13,40.64 13.97,40.64 12.7,41.91 STEER.2
N$23
  Top 0.813: M1.J1.11 31.75,36.83 30.48,35.56 30.48,19.05 R5.2
N$24
  Top 0.813: K4.86 15.75,68.3 D3.A 15.24,73.15 15.24,83.82 10.79,88.27 ON-OFF.4
N$25
  Top 0.813: R12.2 20.32,44.58 OK2.1
N$26
  Top 1.016: OK3.1 20.32,13.97 24.13,10.16 R3.2
N$27
  Top 0.813: M1.J1.10 31.75,39.37 29.21,36.83 29.21,31.88 29.21,31.11 R4.2
N$28
  Top 1.016: OK3.2 17.78,13.79 16.5,12.52 14.14,12.53 12.7,13.97 REMOTE.2
N$29
  Top 0.813: OK1.2 17.78,29.21 16.51,27.94 IMP.2
N$30
  Top 0.813: J8.3 54.61,11.43 45.72,20.32 45.72,33.02 46.99,34.29 M1.J2.12
N$31
  Top 0.813: M1.J1.9 30.48,41.91 R18.2
N$32
  Top 0.813: OK1.1 22.1,30.48 R13.2
N$33
  Bottom 0.813: CAN.4 63.5,16.51 60.96,13.97 49.53,13.97 36.83,26.67 M1.J1.15
N$34
  Bottom 1.016: R5.1 27.94,8.89 26.67,10.16 19.05,10.16 17.78,8.89 OK3.5
N$35
  Top 0.813: C6.1 U2.10
  Bottom 0.813: R17.1 91.44,44.45 88.9,41.91 88.9,35.56 86.36,33.02 C6.1
N$36
  Top 0.813: U2.9 C5.1 90.17,41.91 90.17,43.18 R16.1
N$37
  Bottom 0.813: M1.J1.13 34.29,31.75 50.8,15.24 59.69,15.24 60.96,16.51 CAN.3
N$38
  Top 0.813: U4.SCL 66.17,48.39 63.5,45.72 50.8,45.72 49.53,46.99 M1.J2.7 | U5.SCL 66.04,35.05 63.37,32.38 R1.1
  Bottom 0.813: U2.3 80.52,48.26 79.25,46.99 77.72,46.99 72.72,52 68.51,52 66.17,49.66 U4.SCL 66.04,48.77 U5.SCL
N$39
  Bottom 0.813: OK2.5 19.56,37.34 21.21,37.34 23.62,34.92 R18.1
N$40
  Top 2.286: 39.37,88.27 42.54,85.09 49.61,85.09 U3.5 52.97,85.09 62.23,85.09 12S4.P$1
  Top 2.54: 39.37,88.27 12S3.P$1
N$41  (via drill 0.35)
  Top 0.813: v39.37,63.5 SJ1.2
  Bottom 0.813: U3.2 57.78,89.28 57.78,85.72 55.88,83.82 52.96,83.82 39.37,70.23 v39.37,63.5
N$44
  Top 0.813: U2.8 C4.1 88.27,42.55 88.27,47.62 R7.1
N$47
  Bottom 0.813: R16.2 95.25,36.83 90.17,31.75 90.17,29.21 93.98,25.4 AUX_A/D.4
PWM1
  Top 0.813: R10.2 72.39,6.35 75.44,9.4 82.04,9.4 83.82,7.62 MOTOR.2
  Bottom 0.813: MOTOR1.2 MOTOR.2
PWM2
  Bottom 0.813: MOTOR1.3 MOTOR.3 81.28,9.4 75.44,9.4 73.66,7.62 41.91,7.62 40.64,8.89 34.29,8.89 R14.2
SDA
  Top 0.813: U4.SDA 68.71,48.39 64.77,44.45 M1.J2.8 | U5.SDA 68.58,35.05 R2.1
  Bottom 0.813: U2.4 77.09,45.72 72.09,50.72 69.77,50.72 68.71,49.66 U4.SDA 68.71,47.66 67.31,46.26 67.31,42.64 68.58,41.37 U5.SDA
SW_RAW  (via drill 0.6)  (13 unrouted)
  Top 0.813: 12S2.P$1 ON-OFF.1
  Top 2.286: U3.3 50.16,90.17 45.72,94.61 32,94.61 29.21,91.82
  Top 2.54: 12S1.P$1 29.21,91.82
  other vias: 25.4,86.36 29.21,83.82 26.67,72.39 29.21,74.93 25.4,64.77 24.13,73.66 24.13,68.58
  pour Bottom (isolate 0.406): 17.4,93.98 17.4,86.74 21.59,82.55 21.59,57.15 22.86,55.88 26.67,55.88 28.7,57.78 28.7,65.53 36.45,73.28 36.58,73.28 36.58,82.8 31.5,87.88 31.5,93.98
  pour Top (isolate 0.406): 17.4,93.98 17.4,86.74 21.59,82.55 21.59,57.15 22.86,55.88 26.67,55.88 28.7,57.78 28.7,65.53 36.45,73.28 36.58,73.28 36.58,82.8 31.5,87.88 31.5,93.98
V+WAS
  Top 1.016: W.A.S..4 C23.+
  Top 1.676: IC2.OUT 59.69,73.66 R19.2 62.87,71.75 79.38,71.75 C23.+
(copper drawn outside any net)
  shapes: Top area x4

### Text on the board
tPlace: C1 | NO | GND | +12V | Out | Sw Out | +12v / Out | +12V | Gnd | +12V | Gnd | Sw Out | +12V | Gnd | Gnd | +5v | High | Low | Gnd | C21 | + | _ | +12Vin | +12V | Gnd | Out | Reset | 3 | 2 | 1 | IBT2 ( | MD13S ( | +15 | BRN | BLK | 0 | Gnd | BLU | +15 | BRN | BLK | 0 | GND | 3v3 | SDA | SCL | Gnd | +5V | A3 | A2 | Gnd | BLU | BRN | +15 | Int(D2) | Gnd | Pwm2 | Pwm1 | Dir1 | CS | SO | SI | BLK | +5V | Gnd | SCK | (D5) | 0 | A3 | A2 | A1 | A0 | 5V | Gnd | BLU | GND | Analog in | Motor/Valve | KaupoiMOD AgOpenGPS PCB v4.1 | Gnd | Pwm2 | Pwm1 | Dir1
tNames: GND | 1000uF 35VDC | Power / LED | Batt | 1000uF 35VDC | VX7805-1000 | 1000uF 35VDC | 1000uF 35VDC | 1N5401 | 86 | 0Ohm | VX7805-1000 | 85 | ARDUINO-NANO-3.0 | ADS1115 | IMU | R5 | CMPS14: heading